# Altium schematic sheet [8]-Interface_RS485.SchDoc
size A4
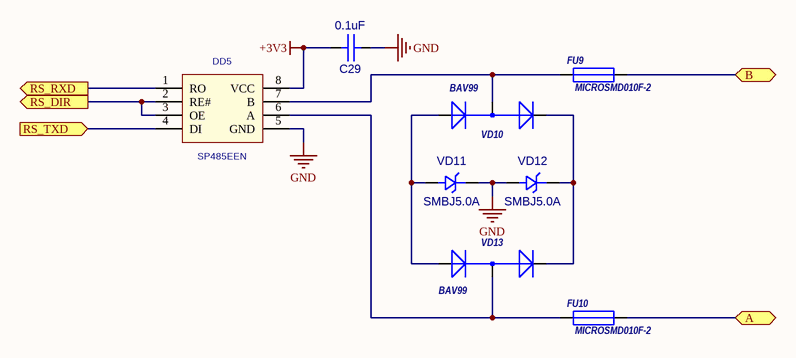
[diagram p0: [8]-Interface_RS485.SchDoc]

## Parts
C29  0.1uF  [CC0603]
DD5  SP485EEN  [SO-8]
FU9  MICROSMD010F-2  [RC1210]
FU10  MICROSMD010F-2  [RC1210]
VD10  BAV99  [SOT-23(GSD)]
VD11  SMBJ5.0A  [SMB]
VD12  SMBJ5.0A  [SMB]
VD13  BAV99  [SOT-23(GSD)]

## Ports
A (bidir), B (bidir), RS_DIR (out), RS_RXD (out), RS_TXD (in)

## Nets
+3V3: C29.2(B) DD5.8(VCC)
GND: C29.1(A) DD5.5(GND) VD11.2(K) VD12.1(A)
A: FU10.2 ; port A
B: FU9.2 ; port B
RS_DIR: DD5.2(RE#) DD5.3(OE) ; port RS_DIR
RS_RXD: DD5.1(RO) ; port RS_RXD
RS_TXD: DD5.4(DI) ; port RS_TXD
NetDD5_6: DD5.6(A) FU10.1 VD13.3(AK)
NetDD5_7: DD5.7(B) FU9.1 VD10.3(AK)
NetVD10_1: VD10.1(A) VD11.1(A) VD13.1(A)
NetVD10_2: VD10.2(K) VD12.2(K) VD13.2(K)

## Library data of the parts
C29 = CC0603: Value: 0.1uF
DD5 = SP485: Value: *
FU9 FU10 = MICROSMD: Value: MICROSMD010F-2
VD10 VD13 = BAV99: 1.0 Ampere General Purpose Rectifier; ComponentField6: Published 8-Jun-2000, Modified 11-July-2000: SIM Model Added.; Value: *
VD11 VD12 = SMBJ: Value: SMBJ5.0A